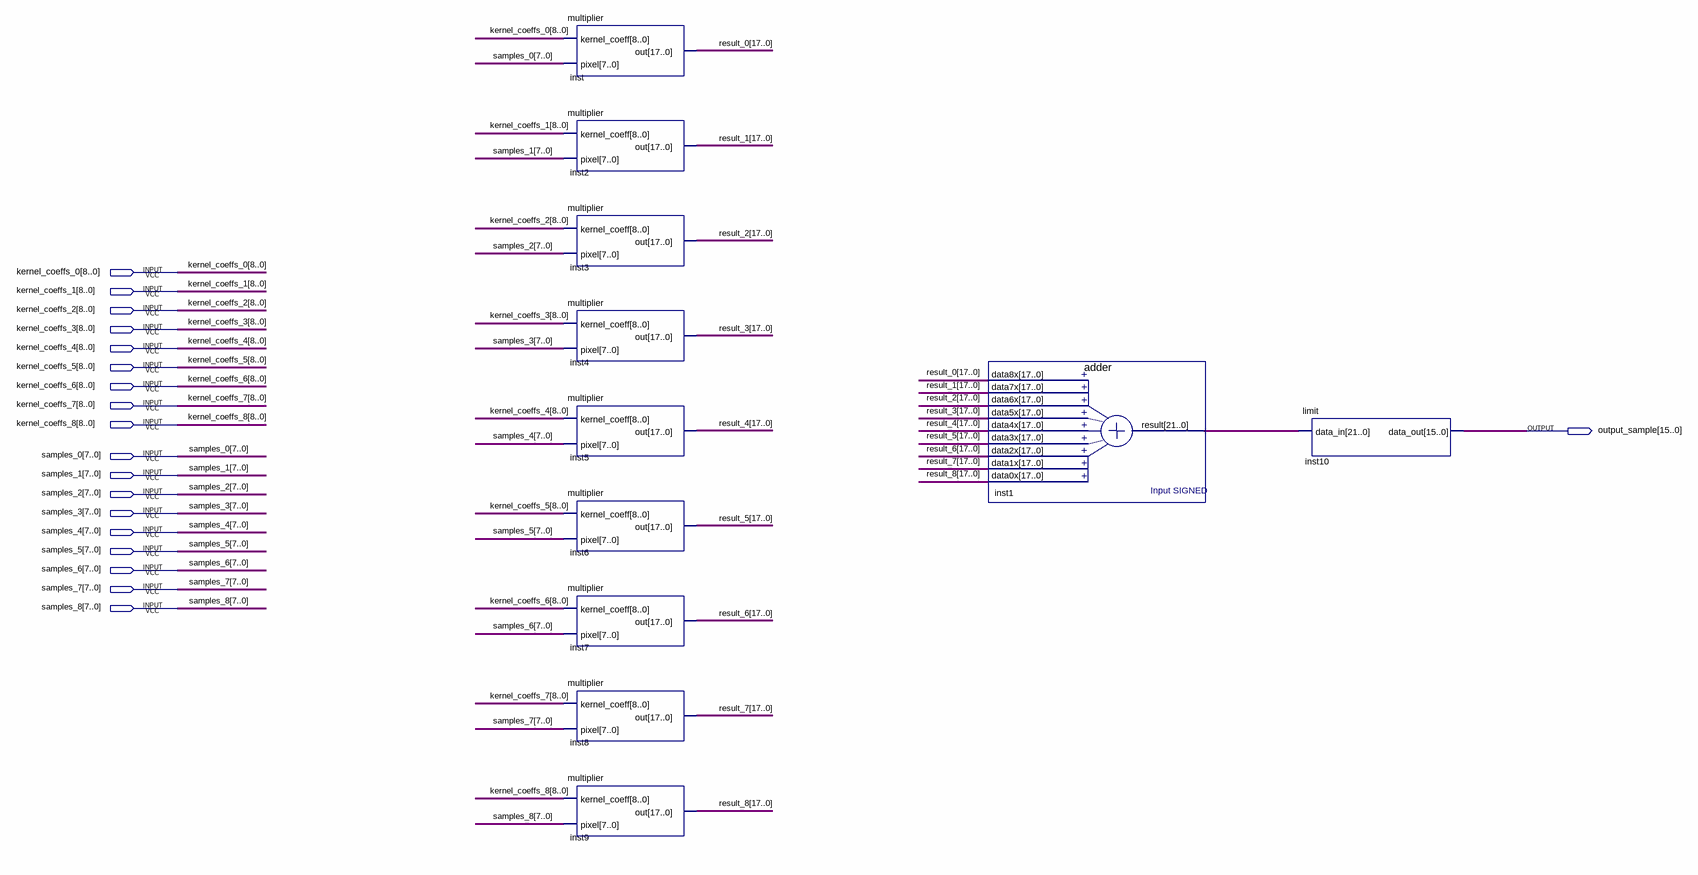
[diagram p0: schematic sheet]
// Quartus schematic kernel_applier.bdf as structural Verilog: 11 symbols, 19 pins
module kernel_applier (
  input  [8:0] kernel_coeffs_0,
  input  [8:0] kernel_coeffs_1,
  input  [8:0] kernel_coeffs_2,
  input  [8:0] kernel_coeffs_3,
  input  [8:0] kernel_coeffs_4,
  input  [8:0] kernel_coeffs_5,
  input  [8:0] kernel_coeffs_6,
  input  [8:0] kernel_coeffs_7,
  input  [8:0] kernel_coeffs_8,
  input  [7:0] samples_0,
  input  [7:0] samples_1,
  input  [7:0] samples_2,
  input  [7:0] samples_3,
  input  [7:0] samples_4,
  input  [7:0] samples_5,
  input  [7:0] samples_6,
  input  [7:0] samples_7,
  input  [7:0] samples_8,
  output [15:0] output_sample
);

  wire [17:0] result_0, result_1, result_2, result_3, result_4, result_5, result_6, result_7, result_8;
  wire [21:0] inst1_result;

  multiplier inst (.kernel_coeff(kernel_coeffs_0), .pixel(samples_0), .out(result_0));
  multiplier inst2 (.kernel_coeff(kernel_coeffs_1), .pixel(samples_1), .out(result_1));
  multiplier inst3 (.kernel_coeff(kernel_coeffs_2), .pixel(samples_2), .out(result_2));
  multiplier inst4 (.kernel_coeff(kernel_coeffs_3), .pixel(samples_3), .out(result_3));
  multiplier inst5 (.kernel_coeff(kernel_coeffs_4), .pixel(samples_4), .out(result_4));
  multiplier inst6 (.kernel_coeff(kernel_coeffs_5), .pixel(samples_5), .out(result_5));
  multiplier inst7 (.kernel_coeff(kernel_coeffs_6), .pixel(samples_6), .out(result_6));
  multiplier inst8 (.kernel_coeff(kernel_coeffs_7), .pixel(samples_7), .out(result_7));
  multiplier inst9 (.kernel_coeff(kernel_coeffs_8), .pixel(samples_8), .out(result_8));
  adder inst1 (
    .data8x(result_0), .data7x(result_1), .data6x(result_2), .data5x(result_3), .data4x(result_4),
    .data3x(result_5), .data2x(result_6), .data1x(result_7), .data0x(result_8), .result(inst1_result));
  limit inst10 (.data_in(inst1_result), .data_out(output_sample));
endmodule
